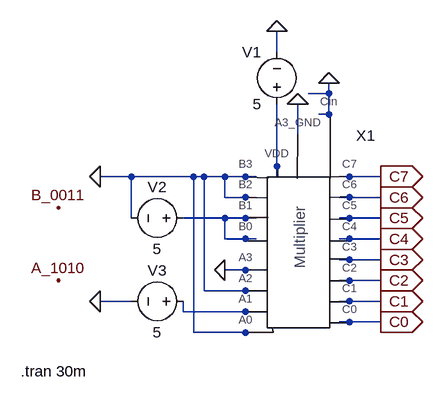
[diagram p0: schematic Draft3.asc]
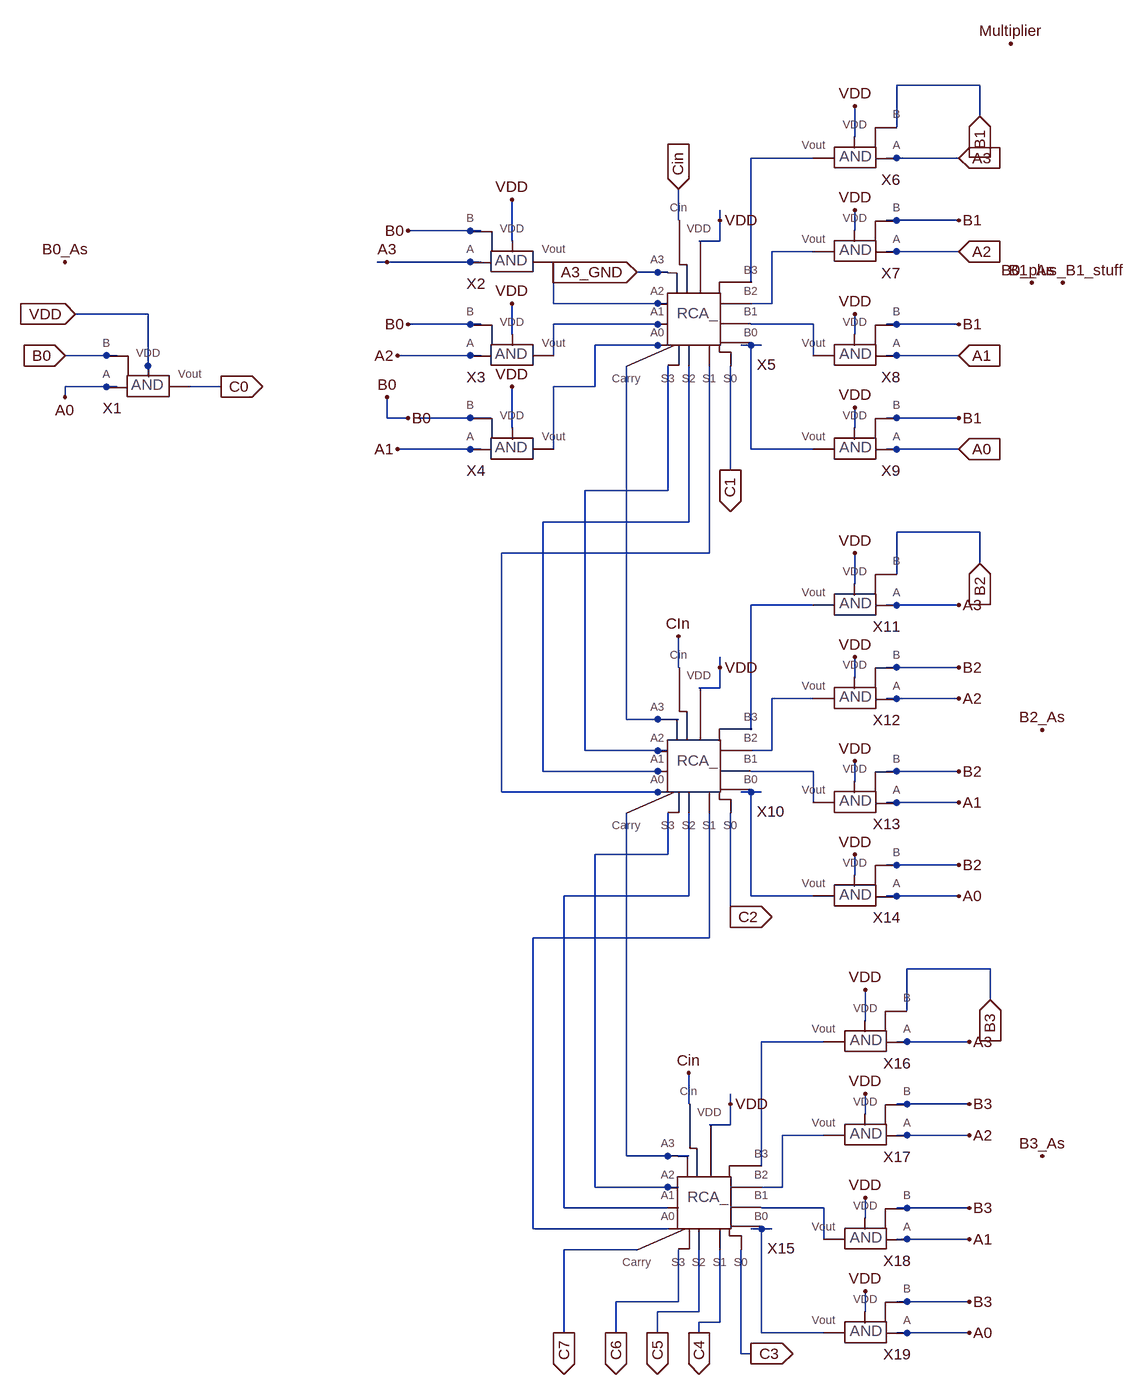
[diagram p1: sub-circuit multiplier.asc]
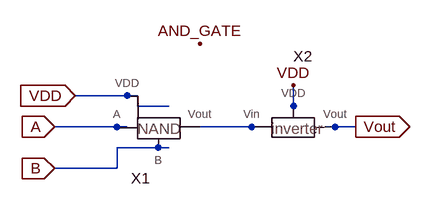
[diagram p2: sub-circuit and_gate.asc]
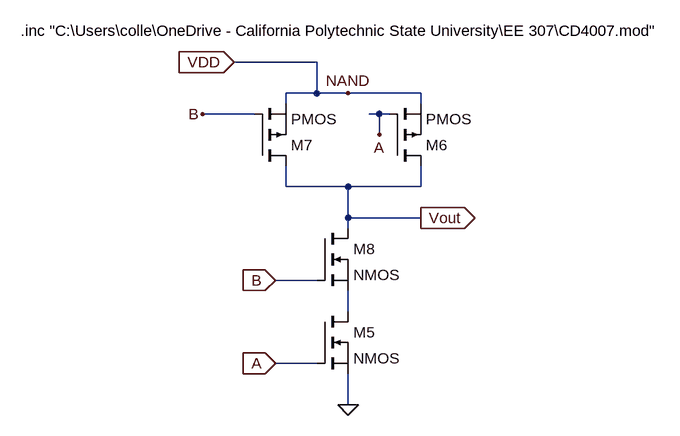
[diagram p3: sub-circuit nand_gate.asc]
Draft3.asc, the LTspice schematic file:
Version 4
SHEET 1 880 680
WIRE 160 -64 160 -96
WIRE 240 0 240 -16
WIRE 240 0 208 0
WIRE 240 32 240 0
WIRE 240 32 224 32
WIRE 192 64 192 16
WIRE 160 112 160 16
WIRE -64 128 -112 128
WIRE 32 128 -64 128
WIRE 48 128 32 128
WIRE 80 128 48 128
WIRE 112 128 80 128
WIRE 128 128 112 128
WIRE 160 128 160 112
WIRE 272 128 256 128
WIRE 320 128 272 128
WIRE 80 160 80 128
WIRE 112 160 80 160
WIRE 128 160 112 160
WIRE 272 160 256 160
WIRE 320 160 272 160
WIRE -64 192 -64 128
WIRE 80 192 16 192
WIRE 112 192 80 192
WIRE 128 192 112 192
WIRE 272 192 256 192
WIRE 320 192 272 192
WIRE 80 224 80 192
WIRE 112 224 80 224
WIRE 128 224 112 224
WIRE 272 224 256 224
WIRE 320 224 272 224
WIRE 272 256 256 256
WIRE 320 256 272 256
WIRE 112 272 80 272
WIRE 128 272 112 272
WIRE 272 288 256 288
WIRE 320 288 272 288
WIRE 48 304 48 128
WIRE 112 304 48 304
WIRE 128 304 112 304
WIRE -64 320 -112 320
WIRE 272 320 256 320
WIRE 320 320 272 320
WIRE 16 336 16 320
WIRE 112 336 16 336
WIRE 128 336 112 336
WIRE 272 352 256 352
WIRE 320 352 272 352
WIRE 32 368 32 128
WIRE 112 368 32 368
WIRE 128 368 112 368
FLAG 240 -16 0
FLAG -112 128 0
FLAG -176 176 B_0011
FLAG -176 288 A_1010
FLAG 320 128 C7
IOPIN 320 128 Out
FLAG 320 160 C6
IOPIN 320 160 Out
FLAG 320 192 C5
IOPIN 320 192 Out
FLAG 320 224 C4
IOPIN 320 224 Out
FLAG 320 256 C3
IOPIN 320 256 Out
FLAG 320 288 C2
IOPIN 320 288 Out
FLAG 320 320 C1
IOPIN 320 320 Out
FLAG 320 352 C0
IOPIN 320 352 Out
FLAG 160 -96 0
FLAG -112 320 0
FLAG 192 16 0
FLAG 80 272 0
SYMBOL Multiplier 224 224 R0
SYMATTR InstName X1
SYMBOL voltage 160 32 R180
WINDOW 0 24 96 Left 2
WINDOW 3 24 16 Left 2
WINDOW 123 0 0 Left 2
WINDOW 39 0 0 Left 2
SYMATTR InstName V1
SYMATTR Value 5
SYMBOL voltage 32 192 R90
WINDOW 0 -32 56 VBottom 2
WINDOW 3 32 56 VTop 2
WINDOW 123 0 0 Left 2
WINDOW 39 0 0 Left 2
SYMATTR InstName V2
SYMATTR Value 5
SYMBOL voltage 32 320 R90
WINDOW 0 -32 56 VBottom 2
WINDOW 3 32 56 VTop 2
WINDOW 123 0 0 Left 2
WINDOW 39 0 0 Left 2
SYMATTR InstName V3
SYMATTR Value 5
TEXT -234 428 Left 2 !.tran 30m

multiplier.asc, the sub-circuit schematic file:
Version 4
SHEET 1 1772 1992
WIRE 512 -176 384 -176
WIRE 512 -128 512 -176
WIRE 384 -112 384 -176
WIRE 320 -96 320 -144
WIRE 256 -64 160 -64
WIRE 384 -64 368 -64
WIRE 480 -64 384 -64
WIRE 48 32 48 -16
WIRE 112 32 112 16
WIRE 384 32 368 32
WIRE 480 32 384 32
WIRE -272 48 -368 48
WIRE -256 48 -272 48
WIRE 320 48 320 16
WIRE -208 64 -208 0
WIRE 112 64 112 32
WIRE 112 64 80 64
WIRE 256 80 192 80
WIRE 384 80 368 80
WIRE 480 80 384 80
WIRE -400 96 -416 96
WIRE -272 96 -400 96
WIRE -256 96 -272 96
WIRE 16 112 -16 112
WIRE 32 112 16 112
WIRE 160 128 160 -64
WIRE -144 160 -144 96
WIRE 16 160 -144 160
WIRE 32 160 16 160
WIRE 192 160 192 80
WIRE 192 160 160 160
WIRE -768 176 -880 176
WIRE -272 192 -368 192
WIRE -256 192 -272 192
WIRE 16 192 -144 192
WIRE 32 192 16 192
WIRE 256 192 160 192
WIRE 384 192 368 192
WIRE 480 192 384 192
WIRE -208 208 -208 160
WIRE 320 208 320 176
WIRE 16 224 -80 224
WIRE 32 224 16 224
WIRE 160 224 144 224
WIRE 176 224 160 224
WIRE -832 240 -896 240
WIRE -816 240 -832 240
WIRE -272 240 -384 240
WIRE -256 240 -272 240
WIRE -144 240 -144 192
WIRE 256 240 256 192
WIRE 384 240 368 240
WIRE 480 240 384 240
WIRE -768 256 -768 176
WIRE -768 272 -768 256
WIRE -832 288 -896 288
WIRE -816 288 -832 288
WIRE -656 288 -704 288
WIRE -80 288 -80 224
WIRE -80 288 -144 288
WIRE -896 304 -896 288
WIRE -400 336 -400 304
WIRE -368 336 -400 336
WIRE -272 336 -352 336
WIRE -240 336 -272 336
WIRE 384 336 368 336
WIRE 480 336 384 336
WIRE -208 352 -208 288
WIRE 320 352 320 320
WIRE -272 384 -384 384
WIRE -256 384 -272 384
WIRE -144 384 -144 288
WIRE 160 384 160 224
WIRE 256 384 160 384
WIRE 384 384 368 384
WIRE 480 384 384 384
WIRE 128 416 128 256
WIRE 32 448 32 256
WIRE 32 448 -96 448
WIRE 64 496 64 256
WIRE 64 496 -160 496
WIRE 512 512 384 512
WIRE 96 544 96 256
WIRE 96 544 -224 544
WIRE 512 560 512 512
WIRE 384 576 384 512
WIRE 320 592 320 544
WIRE 256 624 160 624
WIRE 384 624 368 624
WIRE 480 624 384 624
WIRE 48 720 48 672
WIRE 112 720 112 704
WIRE 384 720 368 720
WIRE 480 720 384 720
WIRE 320 736 320 704
WIRE 112 752 112 720
WIRE 112 752 80 752
WIRE 256 768 192 768
WIRE 384 768 368 768
WIRE 480 768 384 768
WIRE -32 800 -32 256
WIRE 16 800 -32 800
WIRE 48 800 16 800
WIRE 160 816 160 624
WIRE -96 848 -96 448
WIRE 16 848 -96 848
WIRE 32 848 16 848
WIRE 192 848 192 768
WIRE 192 848 160 848
WIRE -160 880 -160 496
WIRE 16 880 -160 880
WIRE 32 880 16 880
WIRE 256 880 160 880
WIRE 384 880 368 880
WIRE 480 880 384 880
WIRE 320 896 320 864
WIRE -224 912 -224 544
WIRE 16 912 -224 912
WIRE 32 912 16 912
WIRE 160 912 144 912
WIRE 176 912 160 912
WIRE 256 928 256 880
WIRE 384 928 368 928
WIRE 480 928 384 928
WIRE 32 1008 32 944
WIRE 32 1008 -80 1008
WIRE 384 1024 368 1024
WIRE 480 1024 384 1024
WIRE 320 1040 320 1008
WIRE 64 1072 64 944
WIRE 64 1072 -128 1072
WIRE 160 1072 160 912
WIRE 256 1072 160 1072
WIRE 384 1072 368 1072
WIRE 480 1072 384 1072
WIRE 128 1104 128 944
WIRE 128 1120 128 1104
WIRE 96 1136 96 944
WIRE 96 1136 -176 1136
WIRE 528 1184 400 1184
WIRE 528 1232 528 1184
WIRE 400 1248 400 1184
WIRE 336 1264 336 1216
WIRE 272 1296 176 1296
WIRE 400 1296 384 1296
WIRE 496 1296 400 1296
WIRE 64 1392 64 1344
WIRE 128 1392 128 1376
WIRE 400 1392 384 1392
WIRE 496 1392 400 1392
WIRE 336 1408 336 1376
WIRE 128 1424 128 1392
WIRE 128 1424 96 1424
WIRE 272 1440 208 1440
WIRE 400 1440 384 1440
WIRE 496 1440 400 1440
WIRE -32 1472 -32 944
WIRE 32 1472 -32 1472
WIRE 64 1472 32 1472
WIRE 176 1488 176 1296
WIRE -80 1520 -80 1008
WIRE 32 1520 -80 1520
WIRE 48 1520 32 1520
WIRE 208 1520 208 1440
WIRE 208 1520 176 1520
WIRE -128 1552 -128 1072
WIRE 32 1552 -128 1552
WIRE 272 1552 176 1552
WIRE 400 1552 384 1552
WIRE 496 1552 400 1552
WIRE 336 1568 336 1536
WIRE -176 1584 -176 1136
WIRE 32 1584 -176 1584
WIRE 176 1584 160 1584
WIRE 192 1584 176 1584
WIRE 272 1600 272 1552
WIRE 400 1600 384 1600
WIRE 496 1600 400 1600
WIRE -16 1616 -128 1616
WIRE 48 1696 48 1616
WIRE 48 1696 -48 1696
WIRE 400 1696 384 1696
WIRE 496 1696 400 1696
WIRE 80 1712 80 1616
WIRE 80 1712 16 1712
WIRE 336 1712 336 1680
WIRE 112 1728 112 1616
WIRE 112 1728 80 1728
WIRE -128 1744 -128 1616
WIRE -48 1744 -48 1696
WIRE 16 1744 16 1712
WIRE 80 1744 80 1728
WIRE 176 1744 176 1584
WIRE 272 1744 176 1744
WIRE 400 1744 384 1744
WIRE 496 1744 400 1744
WIRE 144 1776 144 1616
WIRE 160 1776 144 1776
FLAG 640 128 B0_plus_B1_stuff
FLAG -896 96 B0_As
FLAG 592 128 B1_As
FLAG 608 816 B2_As
FLAG 608 1472 B3_As
FLAG -656 288 C0
IOPIN -656 288 Out
FLAG 128 416 C1
IOPIN 128 416 Out
FLAG 160 1776 C3
IOPIN 160 1776 Out
FLAG 80 1744 C4
IOPIN 80 1744 Out
FLAG 16 1744 C5
IOPIN 16 1744 Out
FLAG -48 1744 C6
IOPIN -48 1744 Out
FLAG -128 1744 C7
IOPIN -128 1744 Out
FLAG -896 240 B0
IOPIN -896 240 In
FLAG -368 48 B0
FLAG -368 192 B0
FLAG -368 336 B0
FLAG -896 304 A0
FLAG 480 384 A0
IOPIN 480 384 In
FLAG 480 240 A1
IOPIN 480 240 In
FLAG 480 80 A2
IOPIN 480 80 In
FLAG 480 -64 A3
IOPIN 480 -64 In
FLAG 512 -128 B1
IOPIN 512 -128 In
FLAG 480 32 B1
FLAG 480 336 B1
FLAG 480 192 B1
FLAG -880 176 VDD
IOPIN -880 176 In
FLAG 112 32 VDD
FLAG 320 -144 VDD
FLAG 320 16 VDD
FLAG 320 176 VDD
FLAG 320 320 VDD
FLAG 128 1104 C2
IOPIN 128 1104 Out
FLAG 480 1072 A0
FLAG 480 928 A1
FLAG 480 768 A2
FLAG 480 624 A3
FLAG 512 560 B2
IOPIN 512 560 In
FLAG 480 720 B2
FLAG 480 1024 B2
FLAG 480 880 B2
FLAG 112 720 VDD
FLAG 320 544 VDD
FLAG 320 704 VDD
FLAG 320 864 VDD
FLAG 320 1008 VDD
FLAG 496 1744 A0
FLAG 496 1600 A1
FLAG 496 1440 A2
FLAG 496 1296 A3
FLAG 528 1232 B3
IOPIN 528 1232 In
FLAG 496 1392 B3
FLAG 496 1696 B3
FLAG 496 1552 B3
FLAG 128 1392 VDD
FLAG 336 1216 VDD
FLAG 336 1376 VDD
FLAG 336 1536 VDD
FLAG 336 1680 VDD
FLAG -384 240 A2
FLAG -384 384 A1
FLAG -400 96 A3
FLAG 64 1344 Cin
FLAG 48 672 CIn
FLAG 48 -16 Cin
IOPIN 48 -16 In
FLAG -16 112 A3_GND
IOPIN -16 112 In
FLAG -208 0 VDD
FLAG -208 160 VDD
FLAG -208 288 VDD
FLAG -400 304 B0
FLAG 560 -240 Multiplier
SYMBOL AND_gate -736 288 R0
SYMATTR InstName X1
SYMBOL AND_gate -176 96 R0
SYMATTR InstName X2
SYMBOL AND_gate -176 240 R0
SYMATTR InstName X3
SYMBOL AND_gate -176 384 R0
SYMATTR InstName X4
SYMBOL RCA_ 64 224 R0
SYMATTR InstName X5
SYMBOL AND_gate 288 -64 M0
SYMATTR InstName X6
SYMBOL AND_gate 288 80 M0
SYMATTR InstName X7
SYMBOL AND_gate 288 240 M0
SYMATTR InstName X8
SYMBOL AND_gate 288 384 M0
SYMATTR InstName X9
SYMBOL RCA_ 64 912 R0
SYMATTR InstName X10
SYMBOL AND_gate 288 624 M0
SYMATTR InstName X11
SYMBOL AND_gate 288 768 M0
SYMATTR InstName X12
SYMBOL AND_gate 288 928 M0
SYMATTR InstName X13
SYMBOL AND_gate 288 1072 M0
SYMATTR InstName X14
SYMBOL RCA_ 80 1584 R0
SYMATTR InstName X15
SYMBOL AND_gate 304 1296 M0
SYMATTR InstName X16
SYMBOL AND_gate 304 1440 M0
SYMATTR InstName X17
SYMBOL AND_gate 304 1600 M0
SYMATTR InstName X18
SYMBOL AND_gate 304 1744 M0
SYMATTR InstName X19

and_gate.asc, the sub-circuit schematic file:
Version 4
SHEET 1 880 680
WIRE 80 128 -16 128
WIRE 80 144 80 128
WIRE 128 144 80 144
WIRE 320 144 320 112
WIRE 320 160 320 144
WIRE 64 176 -48 176
WIRE 192 176 176 176
WIRE 256 176 192 176
WIRE 272 176 256 176
WIRE 384 176 368 176
WIRE 416 176 384 176
WIRE 128 208 48 208
WIRE 48 240 48 208
WIRE 48 240 -48 240
FLAG -16 128 VDD
IOPIN -16 128 In
FLAG -48 176 A
IOPIN -48 176 In
FLAG -48 240 B
IOPIN -48 240 In
FLAG 416 176 Vout
IOPIN 416 176 Out
FLAG 320 112 VDD
FLAG 176 48 AND_GATE
SYMBOL Nand_gate 160 192 R0
SYMATTR InstName X1
SYMBOL Inverter 352 192 R0
SYMATTR InstName X2

nand_gate.asc, the sub-circuit schematic file:
Version 4
SHEET 1 880 680
WIRE -224 -192 -352 -192
WIRE -224 -144 -224 -192
WIRE -224 -144 -272 -144
WIRE -176 -144 -224 -144
WIRE -64 -144 -176 -144
WIRE -272 -128 -272 -144
WIRE -64 -128 -64 -144
WIRE -320 -112 -400 -112
WIRE -128 -112 -144 -112
WIRE -112 -112 -128 -112
WIRE -128 -80 -128 -112
WIRE -272 0 -272 -32
WIRE -176 0 -272 0
WIRE -64 0 -64 -32
WIRE -64 0 -176 0
WIRE -176 48 -176 0
WIRE -64 48 -176 48
WIRE -176 64 -176 48
WIRE -224 144 -288 144
WIRE -176 192 -176 160
WIRE -224 272 -288 272
WIRE -176 336 -176 288
FLAG -176 -144 NAND
FLAG -176 336 0
FLAG -288 272 A
IOPIN -288 272 In
FLAG -128 -80 A
FLAG -400 -112 B
FLAG -288 144 B
IOPIN -288 144 In
FLAG -64 48 Vout
IOPIN -64 48 Out
FLAG -352 -192 VDD
IOPIN -352 -192 In
SYMBOL nmos -224 192 R0
SYMATTR InstName M5
SYMBOL pmos -112 -32 M180
SYMATTR InstName M6
SYMBOL pmos -320 -32 M180
SYMATTR InstName M7
SYMBOL nmos -224 64 R0
SYMATTR InstName M8
TEXT -680 -240 Left 2 !.inc "C:\\Users\\colle\\OneDrive - California Polytechnic State University\\EE 307\\CD4007.mod"

The netlist it stands for:
* Draft3.asc
XX1 N001 0 0 0 0 N002 N002 0 0 N003 0 C7 C6 C5 C4 C3 C2 C1 C0 multiplier
V1 N001 0 5
V2 N002 0 5
V3 N003 0 5

* block symbol definitions
.subckt multiplier VDD A3_GND Cin B3 B2 B1 B0 A3 A2 A1 A0 C7 C6 C5 C4 C3 C2 C1 C0
XX1 A0 VDD C0 B0 and_gate
XX2 A3 VDD N003 B0 and_gate
XX3 A2 VDD N004 B0 and_gate
XX4 A1 VDD N006 N008 and_gate
XX5 A3_GND N003 N004 N006 N009 N010 N011 C1 N014 N001 N002 VDD N005 N007 Cin RCA_  ; pins A3 A2 A1 A0 S3 S2 S1 S0 Carry B3 B2 VDD B1 B0 Cin
XX6 A3 VDD N001 B1 and_gate
XX7 A2 VDD N002 B1 and_gate
XX8 A1 VDD N005 B1 and_gate
XX9 A0 VDD N007 B1 and_gate
XX10 N014 N009 N010 N011 N017 N018 N019 C2 N022 N012 N013 VDD N015 N016 Cin RCA_  ; pins A3 A2 A1 A0 S3 S2 S1 S0 Carry B3 B2 VDD B1 B0 Cin
XX11 A3 VDD N012 B2 and_gate
XX12 A2 VDD N013 B2 and_gate
XX13 A1 VDD N015 B2 and_gate
XX14 A0 VDD N016 B2 and_gate
XX15 N022 N017 N018 N019 C6 C5 C4 C3 C7 N020 N021 VDD N023 N024 Cin RCA_  ; pins A3 A2 A1 A0 S3 S2 S1 S0 Carry B3 B2 VDD B1 B0 Cin
XX16 A3 VDD N020 B3 and_gate
XX17 A2 VDD N021 B3 and_gate
XX18 A1 VDD N023 B3 and_gate
XX19 A0 VDD N024 B3 and_gate
.ends multiplier

.subckt and_gate A VDD Vout B
XX1 A B N001 VDD nand_gate
XX2 N001 VDD Vout Inverter  ; pins Vin VDD Vout
.ends and_gate

.subckt nand_gate A B Vout VDD
M5 N001 A 0 0 NMOS
M6 Vout A VDD VDD PMOS
M7 Vout B VDD VDD PMOS
M8 Vout B N001 N001 NMOS
.inc "C:\Users\colle\OneDrive - California Polytechnic State University\EE 307\CD4007.mod"
.ends nand_gate

.model NMOS NMOS
.model PMOS PMOS
.lib standard.mos
.tran 30m
.backanno
.end